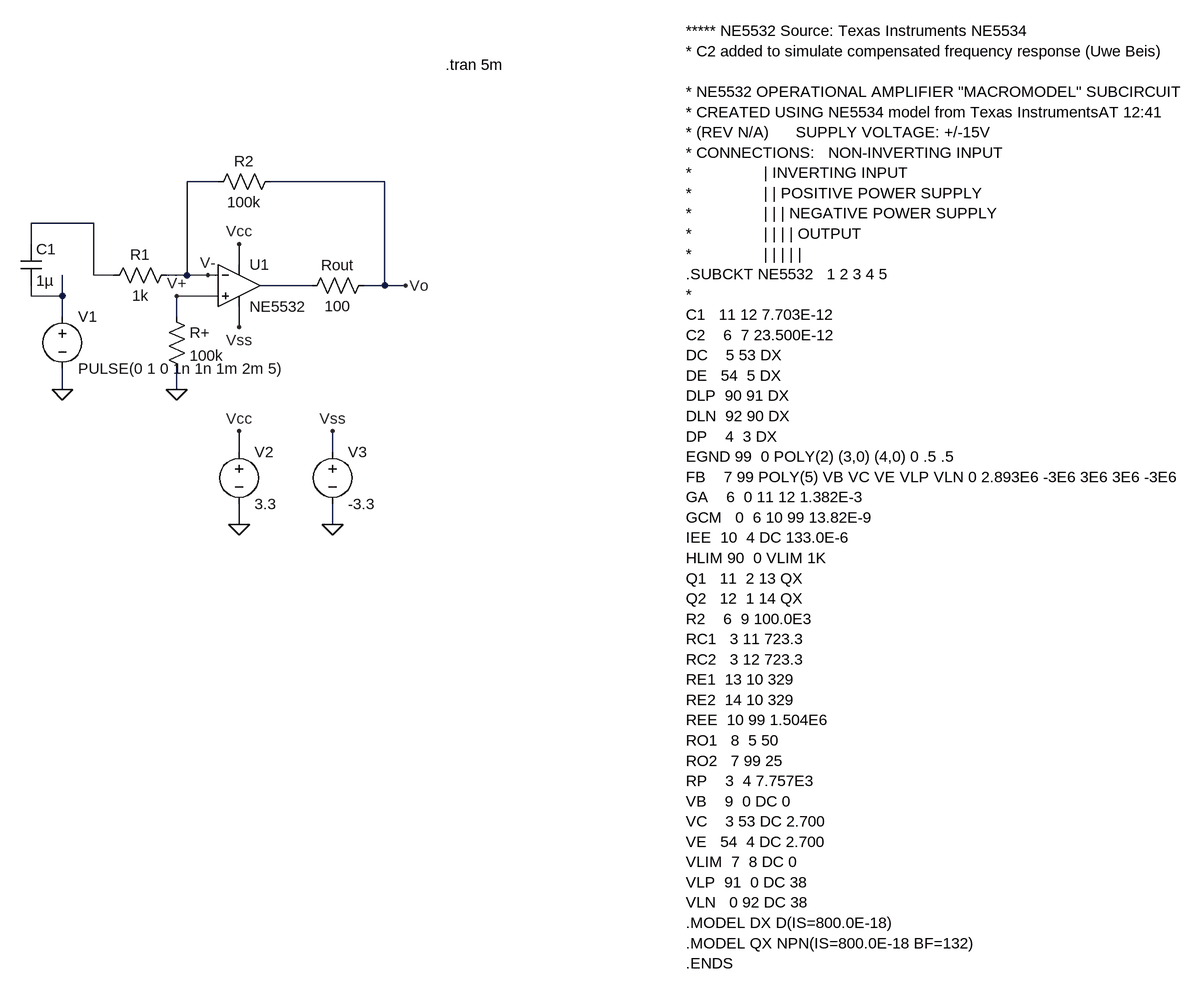
[diagram p0: schematic SchmittTriggerNE5532.asc]
SchmittTriggerNE5532.asc, the LTspice schematic file:
Version 4
SHEET 1 1080 1376
WIRE -416 304 -464 304
WIRE -160 304 -336 304
WIRE -608 368 -704 368
WIRE -704 400 -704 368
WIRE -384 432 -384 400
WIRE -608 448 -608 368
WIRE -576 448 -608 448
WIRE -464 448 -464 304
WIRE -464 448 -496 448
WIRE -432 448 -464 448
WIRE -416 448 -432 448
WIRE -272 464 -352 464
WIRE -160 464 -160 304
WIRE -160 464 -192 464
WIRE -128 464 -160 464
WIRE -704 480 -704 464
WIRE -656 480 -656 448
WIRE -656 480 -704 480
WIRE -416 480 -480 480
WIRE -656 512 -656 480
WIRE -480 512 -480 480
WIRE -384 528 -384 496
WIRE -656 624 -656 592
WIRE -480 624 -480 592
WIRE -384 720 -384 688
WIRE -240 720 -240 688
WIRE -384 832 -384 800
WIRE -240 832 -240 800
FLAG -384 400 Vcc
FLAG -384 528 Vss
FLAG -480 480 V+
FLAG -432 448 V-
FLAG -480 624 0
FLAG -128 464 Vo
FLAG -656 624 0
FLAG -384 688 Vcc
FLAG -384 832 0
FLAG -240 832 0
FLAG -240 688 Vss
SYMBOL Opamps\\opamp2 -384 400 R0
SYMATTR InstName U1
SYMATTR Value NE5532
SYMBOL res -496 496 R0
SYMATTR InstName R+
SYMATTR Value 100k
SYMBOL res -176 448 R90
WINDOW 0 0 56 VBottom 2
WINDOW 3 32 56 VTop 2
SYMATTR InstName Rout
SYMATTR Value 100
SYMBOL res -320 288 R90
WINDOW 0 0 56 VBottom 2
WINDOW 3 32 56 VTop 2
SYMATTR InstName R2
SYMATTR Value 100k
SYMBOL res -480 432 R90
WINDOW 0 0 56 VBottom 2
WINDOW 3 32 56 VTop 2
SYMATTR InstName R1
SYMATTR Value 1k
SYMBOL voltage -656 496 R0
WINDOW 123 0 0 Left 2
WINDOW 39 0 0 Left 2
SYMATTR InstName V1
SYMATTR Value PULSE(0 1 0 1n 1n 1m 2m 5)
SYMBOL voltage -384 704 R0
SYMATTR InstName V2
SYMATTR Value 3.3
SYMBOL voltage -240 704 R0
SYMATTR InstName V3
SYMATTR Value -3.3
SYMBOL cap -720 400 R0
SYMATTR InstName C1
SYMATTR Value 1µ
TEXT 304 72 Left 2 !***** NE5532 Source: Texas Instruments NE5534\n* C2 added to simulate compensated frequency response (Uwe Beis)\n \n* NE5532 OPERATIONAL AMPLIFIER "MACROMODEL" SUBCIRCUIT\n* CREATED USING NE5534 model from Texas InstrumentsAT 12:41\n* (REV N/A)      SUPPLY VOLTAGE: +/-15V\n* CONNECTIONS:   NON-INVERTING INPUT\n*                | INVERTING INPUT\n*                | | POSITIVE POWER SUPPLY\n*                | | | NEGATIVE POWER SUPPLY\n*                | | | | OUTPUT\n*                | | | | |\n.SUBCKT NE5532   1 2 3 4 5\n*\nC1   11 12 7.703E-12\nC2    6  7 23.500E-12\nDC    5 53 DX\nDE   54  5 DX\nDLP  90 91 DX\nDLN  92 90 DX\nDP    4  3 DX\nEGND 99  0 POLY(2) (3,0) (4,0) 0 .5 .5\nFB    7 99 POLY(5) VB VC VE VLP VLN 0 2.893E6 -3E6 3E6 3E6 -3E6\nGA    6  0 11 12 1.382E-3\nGCM   0  6 10 99 13.82E-9\nIEE  10  4 DC 133.0E-6\nHLIM 90  0 VLIM 1K\nQ1   11  2 13 QX\nQ2   12  1 14 QX\nR2    6  9 100.0E3\nRC1   3 11 723.3\nRC2   3 12 723.3\nRE1  13 10 329\nRE2  14 10 329\nREE  10 99 1.504E6\nRO1   8  5 50\nRO2   7 99 25\nRP    3  4 7.757E3\nVB    9  0 DC 0\nVC    3 53 DC 2.700\nVE   54  4 DC 2.700\nVLIM  7  8 DC 0\nVLP  91  0 DC 38\nVLN   0 92 DC 38\n.MODEL DX D(IS=800.0E-18)\n.MODEL QX NPN(IS=800.0E-18 BF=132)\n.ENDS
TEXT -66 124 Left 2 !.tran 5m

The netlist it stands for:
* SchmittTriggerNE5532.asc
XU1 V+ V- Vcc Vss N002 NE5532  ; pins In+ In- V+ V- OUT
R+ V+ 0 100k
Rout Vo N002 100
R2 Vo V- 100k
R1 V- N001 1k
V1 N003 0 PULSE(0 1 0 1n 1n 1m 2m 5)
V2 Vcc 0 3.3
V3 Vss 0 -3.3
C1 N001 N003 1µ
***** NE5532 Source: Texas Instruments NE5534
* C2 added to simulate compensated frequency response (Uwe Beis)
* NE5532 OPERATIONAL AMPLIFIER "MACROMODEL" SUBCIRCUIT
* CREATED USING NE5534 model from Texas InstrumentsAT 12:41
* (REV N/A)      SUPPLY VOLTAGE: +/-15V
* CONNECTIONS:   NON-INVERTING INPUT
*                | INVERTING INPUT
*                | | POSITIVE POWER SUPPLY
*                | | | NEGATIVE POWER SUPPLY
*                | | | | OUTPUT
*                | | | | |
.SUBCKT NE5532   1 2 3 4 5
*
C1   11 12 7.703E-12
C2    6  7 23.500E-12
DC    5 53 DX
DE   54  5 DX
DLP  90 91 DX
DLN  92 90 DX
DP    4  3 DX
EGND 99  0 POLY(2) (3,0) (4,0) 0 .5 .5
FB    7 99 POLY(5) VB VC VE VLP VLN 0 2.893E6 -3E6 3E6 3E6 -3E6
GA    6  0 11 12 1.382E-3
GCM   0  6 10 99 13.82E-9
IEE  10  4 DC 133.0E-6
HLIM 90  0 VLIM 1K
Q1   11  2 13 QX
Q2   12  1 14 QX
R2    6  9 100.0E3
RC1   3 11 723.3
RC2   3 12 723.3
RE1  13 10 329
RE2  14 10 329
REE  10 99 1.504E6
RO1   8  5 50
RO2   7 99 25
RP    3  4 7.757E3
VB    9  0 DC 0
VC    3 53 DC 2.700
VE   54  4 DC 2.700
VLIM  7  8 DC 0
VLP  91  0 DC 38
VLN   0 92 DC 38
.MODEL DX D(IS=800.0E-18)
.MODEL QX NPN(IS=800.0E-18 BF=132)
.ENDS
.tran 5m
.backanno
.end